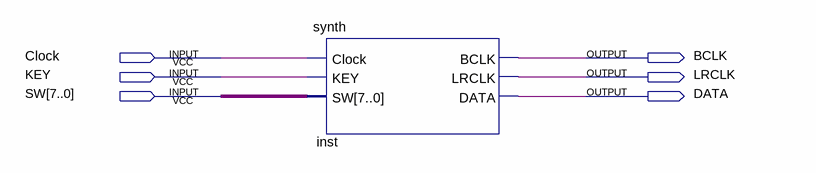
[diagram p0: schematic sheet]
// Quartus schematic final_project.bdf as structural Verilog: 1 symbols, 6 pins
module final_project (
  input  Clock,
  input  KEY,
  input  [7:0] SW,
  output BCLK,
  output LRCLK,
  output DATA
);

  synth inst (.Clock(Clock), .KEY(KEY), .SW(SW), .BCLK(BCLK), .LRCLK(LRCLK), .DATA(DATA));
endmodule
